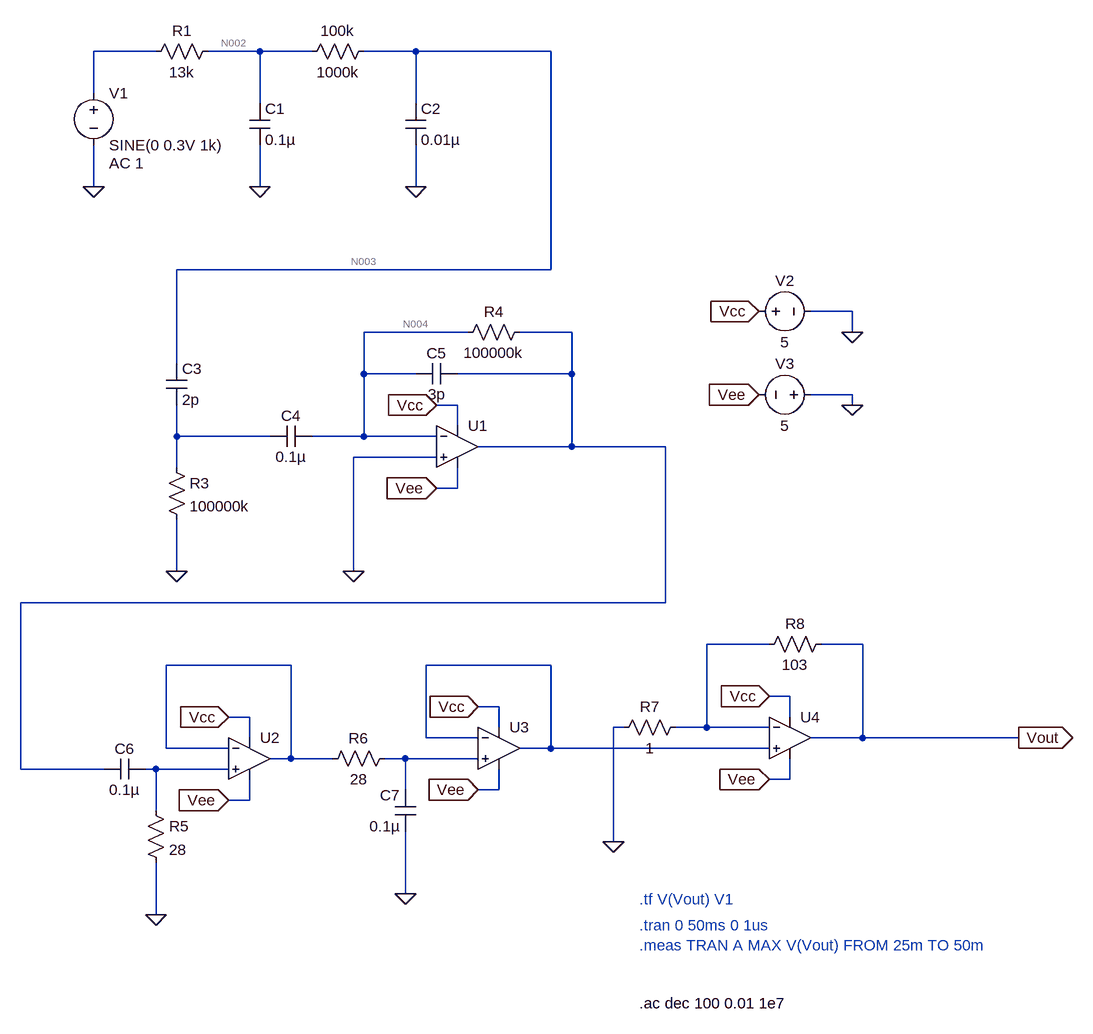
[diagram p0: schematic Draft1.asc]
Draft1.asc, the LTspice schematic file:
Version 4.1
SHEET 1 1584 1496
WIRE 144 16 48 16
WIRE 304 16 224 16
WIRE 384 16 304 16
WIRE 544 16 464 16
WIRE 752 16 544 16
WIRE 48 80 48 16
WIRE 304 96 304 16
WIRE 544 96 544 16
WIRE 48 224 48 160
WIRE 304 224 304 160
WIRE 544 224 544 160
WIRE 752 352 752 16
WIRE 752 352 176 352
WIRE 1216 416 1152 416
WIRE 624 448 464 448
WIRE 784 448 704 448
WIRE 1216 448 1216 416
WIRE 176 496 176 352
WIRE 464 512 464 448
WIRE 544 512 464 512
WIRE 784 512 784 448
WIRE 784 512 608 512
WIRE 1216 544 1152 544
WIRE 608 560 576 560
WIRE 1216 560 1216 544
WIRE 608 592 608 560
WIRE 176 608 176 560
WIRE 320 608 176 608
WIRE 464 608 464 512
WIRE 464 608 384 608
WIRE 576 608 464 608
WIRE 784 624 784 512
WIRE 784 624 640 624
WIRE 928 624 784 624
WIRE 576 640 448 640
WIRE 176 656 176 608
WIRE 608 688 608 656
WIRE 608 688 576 688
WIRE 176 816 176 736
WIRE 448 816 448 640
WIRE 928 864 928 624
WIRE 928 864 -64 864
WIRE 1088 928 992 928
WIRE 1232 928 1168 928
WIRE 352 960 160 960
WIRE 752 960 560 960
WIRE 1120 1008 1088 1008
WIRE 672 1024 640 1024
WIRE 288 1040 256 1040
WIRE 1120 1040 1120 1008
WIRE 672 1056 672 1024
WIRE 864 1056 848 1056
WIRE 992 1056 992 928
WIRE 992 1056 944 1056
WIRE 1088 1056 992 1056
WIRE 288 1072 288 1040
WIRE 560 1072 560 960
WIRE 640 1072 560 1072
WIRE 1232 1072 1232 928
WIRE 1232 1072 1152 1072
WIRE 1472 1072 1232 1072
WIRE 160 1088 160 960
WIRE 256 1088 160 1088
WIRE 752 1088 752 960
WIRE 752 1088 704 1088
WIRE 1088 1088 752 1088
WIRE 352 1104 352 960
WIRE 352 1104 320 1104
WIRE 416 1104 352 1104
WIRE 528 1104 496 1104
WIRE 640 1104 528 1104
WIRE -64 1120 -64 864
WIRE 64 1120 -64 1120
WIRE 144 1120 128 1120
WIRE 256 1120 144 1120
WIRE 1120 1136 1120 1104
WIRE 1120 1136 1088 1136
WIRE 528 1152 528 1104
WIRE 672 1152 672 1120
WIRE 672 1152 640 1152
WIRE 288 1168 288 1136
WIRE 288 1168 256 1168
WIRE 144 1184 144 1120
WIRE 848 1232 848 1056
WIRE 528 1312 528 1216
WIRE 144 1344 144 1264
FLAG 48 224 0
FLAG 176 816 0
FLAG 448 816 0
FLAG 576 560 Vcc
IOPIN 576 560 In
FLAG 576 688 Vee
IOPIN 576 688 In
FLAG 144 1344 0
FLAG 528 1312 0
FLAG 304 224 0
FLAG 544 224 0
FLAG 256 1040 Vcc
IOPIN 256 1040 In
FLAG 256 1168 Vee
IOPIN 256 1168 In
FLAG 640 1024 Vcc
IOPIN 640 1024 In
FLAG 640 1152 Vee
IOPIN 640 1152 In
FLAG 1072 416 Vcc
IOPIN 1072 416 In
FLAG 1072 544 Vee
IOPIN 1072 544 In
FLAG 1216 448 0
FLAG 1216 560 0
FLAG 1088 1008 Vcc
IOPIN 1088 1008 In
FLAG 1088 1136 Vee
IOPIN 1088 1136 In
FLAG 848 1232 0
FLAG 1472 1072 Vout
IOPIN 1472 1072 Out
SYMBOL voltage 48 64 R0
WINDOW 123 24 124 Left 2
WINDOW 39 0 0 Left 0
SYMATTR Value2 AC 1
SYMATTR InstName V1
SYMATTR Value SINE(0 0.3V 1k)
SYMBOL res 240 0 R90
WINDOW 0 0 56 VBottom 2
WINDOW 3 32 56 VTop 2
SYMATTR InstName R1
SYMATTR Value 13k
SYMBOL res 480 0 R90
WINDOW 0 0 56 VBottom 2
WINDOW 3 32 56 VTop 2
SYMATTR InstName 100k
SYMATTR Value 1000k
SYMBOL cap 288 96 R0
SYMATTR InstName C1
SYMATTR Value 0.1µ
SYMBOL cap 528 96 R0
SYMATTR InstName C2
SYMATTR Value 0.01µ
SYMBOL cap 160 496 R0
SYMATTR InstName C3
SYMATTR Value 2p
SYMBOL res 160 640 R0
SYMATTR InstName R3
SYMATTR Value 100000k
SYMBOL cap 384 592 R90
WINDOW 0 0 32 VBottom 2
WINDOW 3 32 32 VTop 2
SYMATTR InstName C4
SYMATTR Value 0.1µ
SYMBOL cap 608 496 R90
WINDOW 0 0 32 VBottom 2
WINDOW 3 32 32 VTop 2
SYMATTR InstName C5
SYMATTR Value 3p
SYMBOL res 720 432 R90
WINDOW 0 0 56 VBottom 2
WINDOW 3 32 56 VTop 2
SYMATTR InstName R4
SYMATTR Value 100000k
SYMBOL OpAmps\\UniversalOpAmp2 608 624 R0
SYMATTR InstName U1
SYMBOL OpAmps\\UniversalOpAmp2 288 1104 R0
SYMATTR InstName U2
SYMBOL OpAmps\\UniversalOpAmp2 672 1088 R0
SYMATTR InstName U3
SYMBOL cap 128 1104 R90
WINDOW 0 0 32 VBottom 2
WINDOW 3 32 32 VTop 2
SYMATTR InstName C6
SYMATTR Value 0.1µ
SYMBOL cap 544 1216 R180
WINDOW 0 24 56 Left 2
WINDOW 3 24 8 Left 2
SYMATTR InstName C7
SYMATTR Value 0.1µ
SYMBOL res 128 1168 R0
SYMATTR InstName R5
SYMATTR Value 28
SYMBOL res 512 1088 R90
WINDOW 0 0 56 VBottom 2
WINDOW 3 32 56 VTop 2
SYMATTR InstName R6
SYMATTR Value 28
SYMBOL voltage 1056 416 R270
WINDOW 0 32 56 VTop 2
WINDOW 3 -32 56 VBottom 2
SYMATTR InstName V2
SYMATTR Value 5
SYMBOL voltage 1168 544 R90
WINDOW 0 -32 56 VBottom 2
WINDOW 3 32 56 VTop 2
SYMATTR InstName V3
SYMATTR Value 5
SYMBOL OpAmps\\UniversalOpAmp2 1120 1072 R0
SYMATTR InstName U4
SYMBOL res 960 1040 R90
WINDOW 0 0 56 VBottom 2
WINDOW 3 32 56 VTop 2
SYMATTR InstName R7
SYMATTR Value 1
SYMBOL res 1184 912 R90
WINDOW 0 0 56 VBottom 2
WINDOW 3 32 56 VTop 2
SYMATTR InstName R8
SYMATTR Value 103
TEXT 888 1360 Left 2 ;.tran 0 50ms 0 1us\n.meas TRAN A MAX V(Vout) FROM 25m TO 50m
TEXT 888 1320 Left 2 ;.tf V(Vout) V1
TEXT 888 1480 Left 2 !.ac dec 100 0.01 1e7

The netlist it stands for:
* Draft1.asc
V1 N001 0 SINE(0 0.3V 1k) AC 1
R1 N002 N001 13k
R§100k N003 N002 1000k
C1 N002 0 0.1µ
C2 N003 0 0.01µ
C3 N003 N006 2p
R3 N006 0 100000k
C4 N004 N006 0.1µ
C5 N005 N004 3p
R4 N005 N004 100000k
X§U1 0 N004 Vcc Vee N005 level2 Avol=1Meg GBW=10Meg Slew=10Meg Ilimit=25m Rail=0 Vos=0 En=0 Enk=0 In=0 Ink=0 Rin=500Meg  ; pins In+ In- V+ V- OUT
X§U2 N011 N008 Vcc Vee N008 level2 Avol=1Meg GBW=10Meg Slew=10Meg Ilimit=25m Rail=0 Vos=0 En=0 Enk=0 In=0 Ink=0 Rin=500Meg  ; pins In+ In- V+ V- OUT
X§U3 N010 N009 Vcc Vee N009 level2 Avol=1Meg GBW=10Meg Slew=10Meg Ilimit=25m Rail=0 Vos=0 En=0 Enk=0 In=0 Ink=0 Rin=500Meg  ; pins In+ In- V+ V- OUT
C6 N011 N005 0.1µ
C7 0 N010 0.1µ
R5 N011 0 28
R6 N010 N008 28
V2 Vcc 0 5
V3 0 Vee 5
X§U4 N009 N007 Vcc Vee Vout level2 Avol=1Meg GBW=10Meg Slew=10Meg Ilimit=25m Rail=0 Vos=0 En=0 Enk=0 In=0 Ink=0 Rin=500Meg  ; pins In+ In- V+ V- OUT
R7 N007 0 1
R8 Vout N007 103
* .tran 0 50ms 0 1us
* .meas TRAN A MAX V(Vout) FROM 25m TO 50m
* .tf V(Vout) V1
.ac dec 100 0.01 1e7
.lib UniversalOpAmp2.lib
.backanno
.end

* Results of the author's LTspice run, read from the files saved beside the schematic
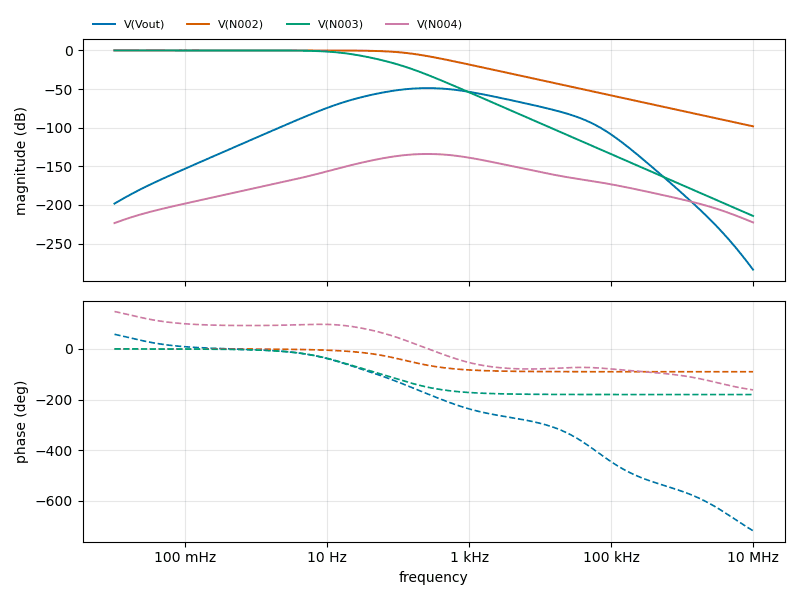
[diagram p1: AC Analysis of Draft1.asc, plotted from the saved traces]
* AC Analysis, 1 run:
*   V(Vout): -198.25 dB at 10 mHz, -283.75 dB at 10 MHz, peak -48.82 dB at 257 Hz, 3 dB below the peak at 90.5 Hz and 745.1 Hz
*   V(N002): -0.00 dB at 10 mHz, -98.24 dB at 10 MHz, peak -0.00 dB at 10 mHz, 3 dB below the peak at 120.6 Hz
*   V(N003): -0.00 dB at 10 mHz, -214.21 dB at 10 MHz, peak -0.00 dB at 10 mHz, 3 dB below the peak at 15.44 Hz
*   V(N004): -223.46 dB at 10 mHz, -222.60 dB at 10 MHz, peak -134.02 dB at 257 Hz, 3 dB below the peak at 89.77 Hz and 744.7 Hz